# Altium schematic sheet Power Managment.SchDoc: Power Managment
size 215 x 139 mm; DrawnBy: Kace Chandler; DocumentNumber: 11; SheetNumber: 11; SheetTotal: 23
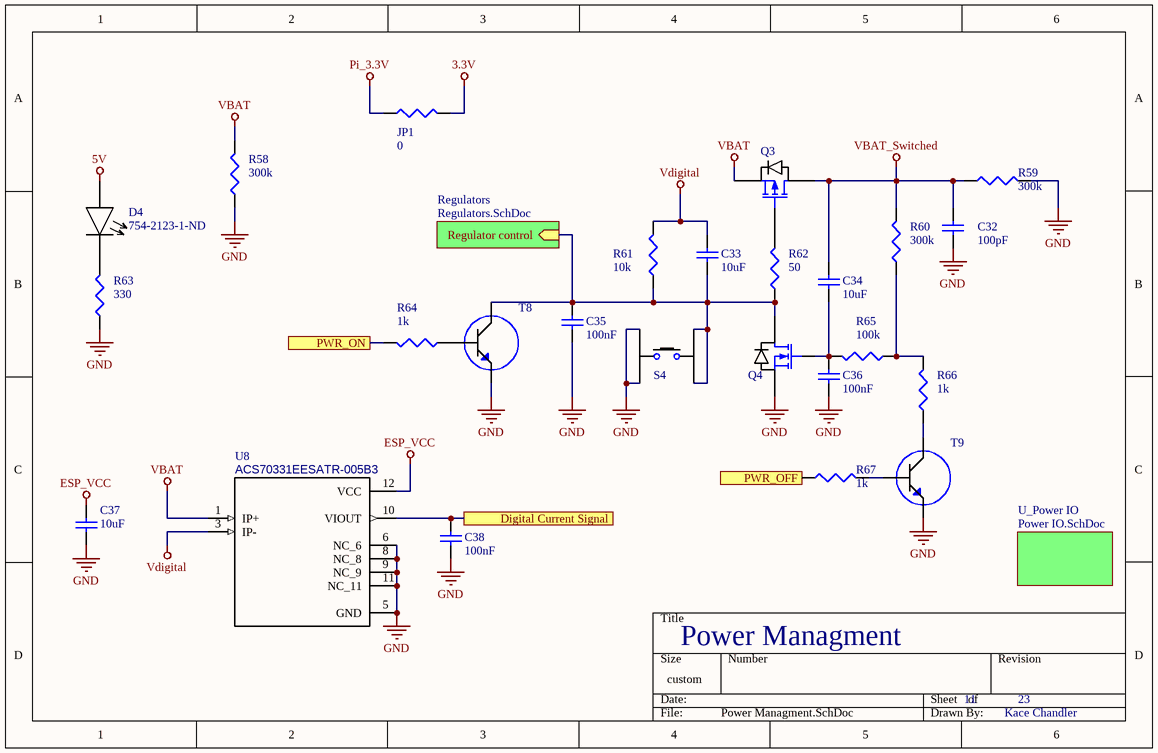
[diagram p0: Power Managment.SchDoc]

## Parts
C32  value 100pF  [Electrolytic Cap]  (hidden comment: Cap)
C33  value 10uF  [0603 to 0805 SMD]  (hidden comment: Cap)
C34  value 10uF  [0603 to 0805 SMD]  (hidden comment: Cap)
C35  value 100nF  [0603 to 0805 SMD]  (hidden comment: Cap)
C36  value 100nF  [0603 to 0805 SMD]  (hidden comment: Cap)
C37  value 10uF  [0805 Footprint]  (hidden comment: Cap)
C38  value 100nF  [0805 Footprint]  (hidden comment: Cap)
D4  Supplier Part Number 1: 754-2123-1-ND  [0402 footprint]  (hidden comment: LED_R)
JP1  value 0  [0603 TO 1210 SMD]  (hidden comment: Res3)
Q3  P-Channel  [P Channel MOSFET]  (value not drawn)
Q4  N-Channel  [N Channel MOSFET]  (value not drawn)
R58  value 300k  [0603 Footprint]  (hidden comment: Res3)
R59  value 300k  [0603 Footprint]  (hidden comment: Res3)
R60  value 300k  [0603 Footprint]  (hidden comment: Res3)
R61  value 10k  [0603 Footprint]  (hidden comment: Res3)
R62  value 50  [0603 Footprint]  (hidden comment: Res3)
R63  value 330  [0603 Footprint]  (hidden comment: Res3)
R64  value 1k  [0603 Footprint]  (hidden comment: Res3)
R65  value 100k  [0603 Footprint]  (hidden comment: Res3)
R66  value 1k  [0603 Footprint]  (hidden comment: Res3)
R67  value 1k  [0603 Footprint]  (hidden comment: Res3)
S4  434153017835  [*434153017835]  (value not drawn)
T8  MMBT2222ALT1  [BJT]  (value not drawn)
T9  MMBT2222ALT1  [BJT]  (value not drawn)
U8  ACS70331EESATR-005B3  [*XDCR_ACS70331EESATR-005B3]

## Sub-sheets
Regulators = Regulators.SchDoc: Regulator control (in)
U_Power IO = Power IO.SchDoc: no entries

## Ports
Digital Current Signal, PWR_OFF, PWR_ON

## Nets
3.3V: JP1.2
5V: D4.1
ESP_VCC: C37.2 U8.12(VCC)
GND: C32.1 C35.1 C36.1 C37.1 C38.1 Q4.2(S) R58.1 R59.2 R63.1 S4.2 S4.4 T8.2(E) T9.2(E) U8.5(GND) U8.6(NC_6) U8.8(NC_8) U8.9(NC_9) U8.11(NC_11)
Pi_3.3V: JP1.1
VBAT: Q3.2(S) R58.2 U8.1(IP+)
VBAT_Switched: C32.2 C34.2 Q3.3(D) R59.1 R60.2
Vdigital: C33.2 R61.2 U8.3(IP-)
Digital Current Signal: C38.2 U8.10(VIOUT) ; port Digital Current Signal
PWR_OFF: R67.1 ; port PWR_OFF
PWR_ON: R64.2 ; port PWR_ON
NetC33_1: C33.1 C35.2 Q4.3(D) R61.1 R62.1 S4.1 S4.3 T8.3(C) ; sheet Regulators/Regulator control
NetC34_1: C34.1 C36.2 Q4.1(G) R65.2
NetD4_2: D4.2 R63.2
NetQ3_1: Q3.1(G) R62.2
NetR60_1: R60.1 R65.1 R66.2
NetR64_1: R64.1 T8.1(B)
NetR66_1: R66.1 T9.3(C)
NetR67_2: R67.2 T9.1(B)

## Library data of the parts
C32-C38 = Cap: Capacitor; Published: 8-Jun-2000; LatestRevisionDate: 17-Jul-2002; LatestRevisionNote: Re-released for DXP Platform.; PackageReference: RAD-0.3; Publisher: Altium Limited; PackageDescription: Radial Cap, Thru-Hole; 2 Leads; 0.3 in Pin Spacing
JP1 R58-R67 = Res3: Resistor; Published: 8-Jun-2000; LatestRevisionDate: 29-May-2009; LatestRevisionNote: IPC-7351 Footprint Added.; PackageReference: J1-0603; Publisher: Altium Limited; PackageDescription: Chip Resistor
S4 = Pushbutton NO: Switch Tactile Spst-No 0.05a 12v; MF: Wurth Electronics; Price: None; Package: None; Availability: Unavailable; SnapEDA_Link: https://www.snapeda.com/parts/434153017835/Wurth%20Electronics%20Inc./view-part/?ref=snap; MP: 434153017835; Value: *; Supplier 1: Digi-Key; Supplier Part Number 1: 732-10143-1-ND
T8 T9 = BJT NPN: Trans NPN 40V 0.6A SOT23; MF: ON Semiconductor; SnapEDA_Link: https://www.snapeda.com/parts/MMBT2222ALT1/ON%20Semiconductor/view-part/?ref=snap; Price: None; Availability: Unavailable; MP: MMBT2222ALT1; Package: SOT-23 Motorola; Value: *; Supplier 1: Digi-Key; Supplier Part Number 1: MMBT2222ATPMSCT-ND
U8 = 2.5A Current Sensor: Current Sensor Current Sensor AC/DC Current 12-Pin QFN EP T/R; MF: Allegro MicroSystems LLC; Availability: Unavailable; Package: WFQFN-12 Allegro MicroSystems LLC; Price: None; SnapEDA_Link: https://www.snapeda.com/parts/ACS70331EESATR-005B3/Allegro%20MicroSystems%20LLC/view-part/?ref=snap; MP: ACS70331EESATR-005B3; Value: *; Supplier 1: Digi-Key; Supplier Part Number 1: 620-1890-1-ND
D4 = LED_R: Supplier 1: Digi-Key
Q3 = P-Channel: Supplier 1: Digi-Key; Supplier Part Number 1: SI2343CDS-T1-GE3CT-ND
Q4 = N-Channel: Supplier 1: Digi-Key; Supplier Part Number 1: SI2338DS-T1-GE3CT-ND